# EAGLE schematic plane (EAGLE 9.6.1)
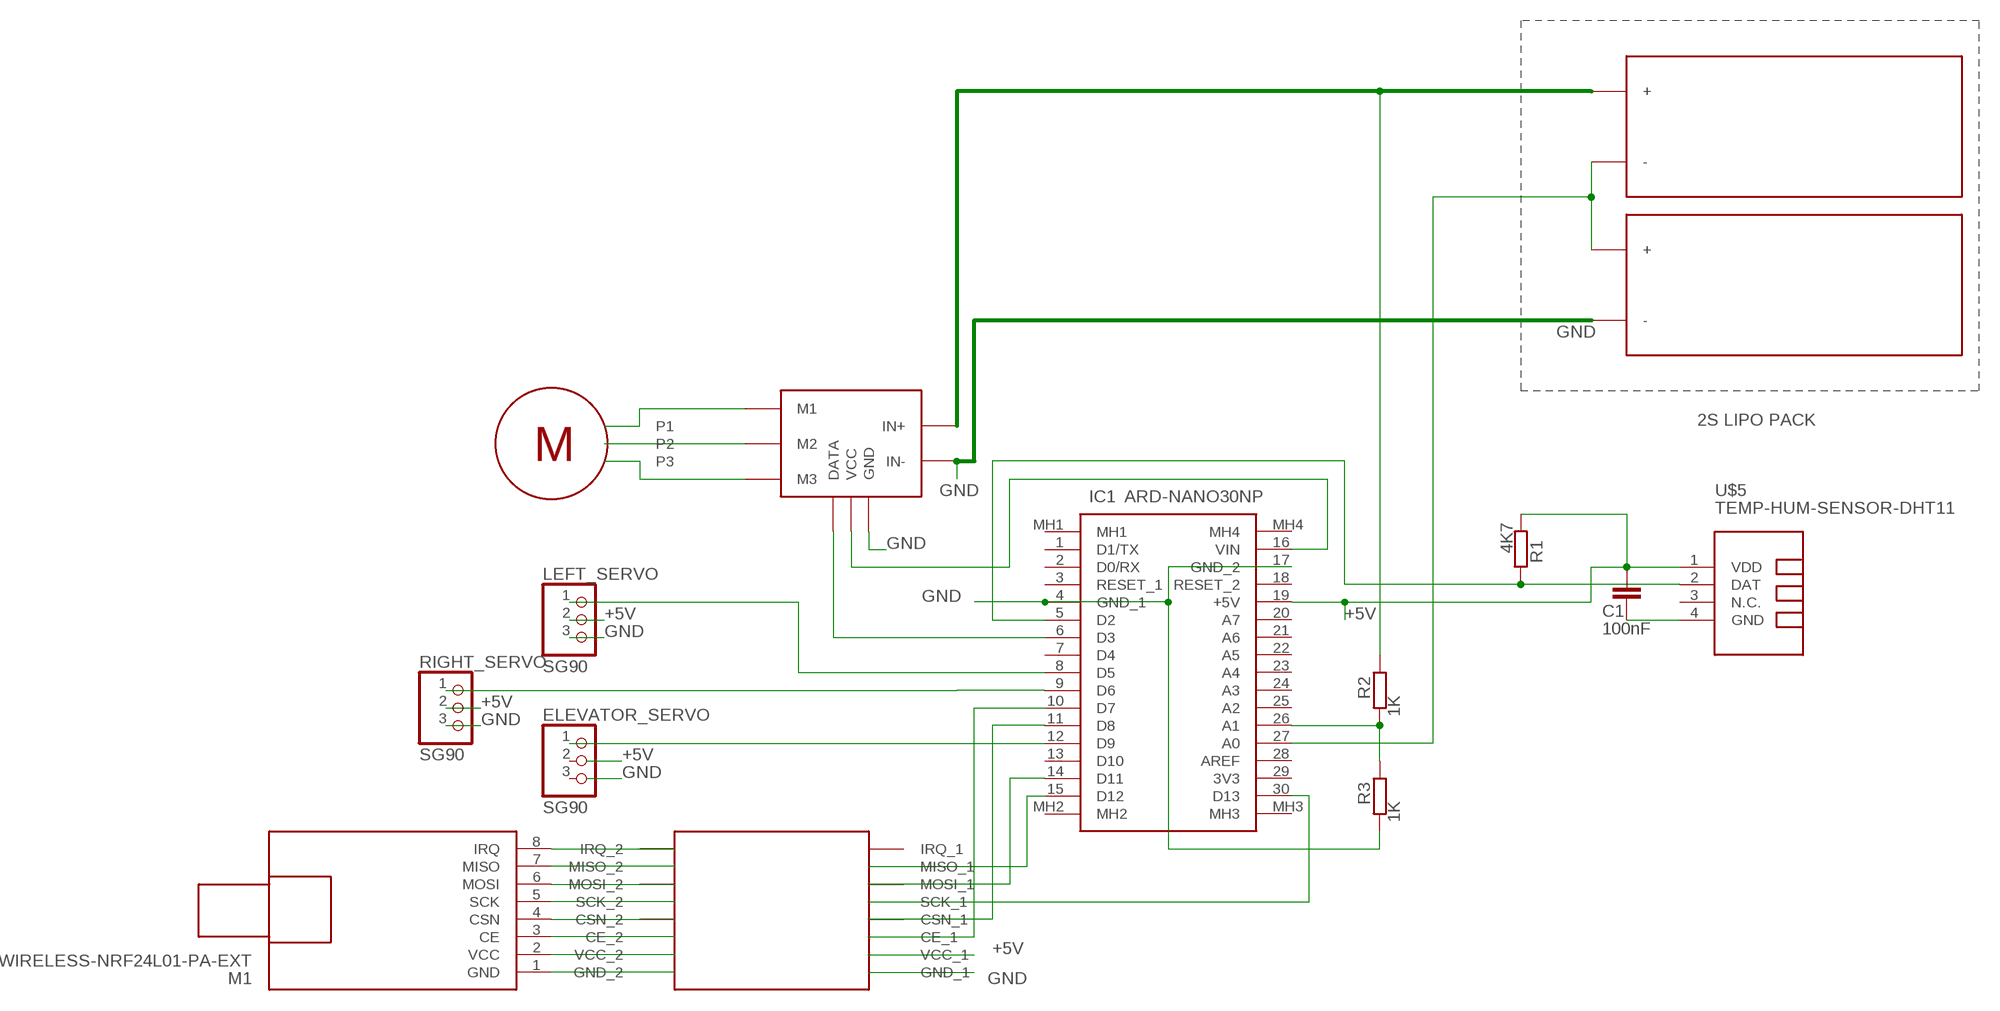
[diagram p0: schematic, sheet 1]

## Parts
C1  100nF  C2,5-3  [C2.5-3]
ELEVATOR_SERVO  SG90  PINHD-1X3  [1X03]
IC1  ARD-NANO30NP  [ARDNANO30NP]
LEFT_SERVO  SG90  PINHD-1X3  [1X03]
M1  WIRELESS-NRF24L01-PA-EXT  [WIRELESS-NRF24L01-PA-EXT]
R1  4K7  SMR  [SMR]
R2  1K  SMR  [SMR]
R3  1K  SMR  [SMR]
RIGHT_SERVO  SG90  PINHD-1X3  [1X03]
U$1  ESC  (no package)
U$2  LIPO-CELL  (no package)
U$3  LIPO-CELL  (no package)
U$4  A2212/6T  (no package)
U$5  TEMP-HUM-SENSOR-DHT11  [TEMP-HUM-SENSOR-DHT11]
U$6  YL-105-ADAPTER-NRF24L01  (no package)

## Nets
+5V: C1.1 IC1.19(+5V) LEFT_SERVO.2 R1.2 RIGHT_SERVO.2 U$5.1(VDD) U$6.VCC_1
GND: IC1.4(GND_1) IC1.17(GND_2) LEFT_SERVO.3 M1.1(GND) R3.2 RIGHT_SERVO.3 U$1.GND U$1.IN- U$2.- U$6.GND_1 U$6.GND_2
N$1: IC1.8(D5) LEFT_SERVO.1
N$2: IC1.9(D6) RIGHT_SERVO.1
N$3: ELEVATOR_SERVO.1 IC1.12(D9)
N$4: IC1.16(VIN) U$1.VCC
N$5: IC1.27(A0) U$2.+ U$3.-
N$6: IC1.26(A1) R2.2 R3.1
N$7: U$1.M1 U$4.P1
N$8: U$1.M2 U$4.P2
N$9: U$1.M3 U$4.P3
N$10: C1.2 U$5.4(GND)
N$11: IC1.5(D2) R1.1 U$5.2(DAT)
N$12: IC1.6(D3) U$1.DATA
N$13: R2.1 U$1.IN+ U$3.+
N$14: M1.2(VCC) U$6.VCC_2
N$15: M1.3(CE) U$6.CE_2
N$16: M1.4(CSN) U$6.CSN_2
N$17: M1.5(SCK) U$6.SCK_2
N$18: M1.6(MOSI) U$6.MOSI_2
N$19: M1.7(MISO) U$6.MISO_2
N$20: M1.8(IRQ) U$6.IRQ_2
N$21: IC1.14(D11) U$6.MOSI_1
N$22: IC1.15(D12) U$6.MISO_1
N$23: IC1.30(D13) U$6.SCK_1
N$24: IC1.10(D7) U$6.CE_1
N$25: IC1.11(D8) U$6.CSN_1
Unconnected: ELEVATOR_SERVO.2 ELEVATOR_SERVO.3 IC1.1(D1/TX) IC1.2(D0/RX) IC1.3(RESET_1) IC1.7(D4) IC1.13(D10) IC1.18(RESET_2) IC1.20(A7) IC1.21(A6) IC1.22(A5) IC1.23(A4) IC1.24(A3) IC1.25(A2) IC1.28(AREF) IC1.29(3V3) IC1.MH1 IC1.MH2 IC1.MH3 IC1.MH4 U$5.3(N.C.) U$6.IRQ_1

## Notes on the sheet
- 2S LIPO PACK

## Library data of the parts
C1 = capacitor-wima:C: CAPACITOR naming: grid - package width
ELEVATOR_SERVO LEFT_SERVO RIGHT_SERVO = adafruit:PINHD-1X3: PIN HEADER
IC1 = SamacSys_Parts:ARD-NANO30NP: Development Boards & Kits - AVR Arduino Nano 3.1 W/ATMEGA328 NO-PIN Source: Datasheet <http://www.mouser.com/datasheet/2/595/Arduino_Nano3_0-220057.pdf>; ARROW_PART_NUMBER: ARD-NANO30NP; DESCRIPTION: Development Boards & Kits - AVR Arduino Nano 3.1 W/ATMEGA328 NO-PIN; HEIGHT: 5mm; MANUFACTURER_NAME: Gravitech; MANUFACTURER_PART_NUMBER: ARD-NANO30NP; MOUSER_PART_NUMBER: 992-ARD-NANO30NP; MOUSER_PRICE-STOCK: https://www.mouser.co.uk/ProductDetail/Gravitech/ARD-NANO30NP?qs=Vxac6xGyzPlh7in3DWNTbQ%3D%3D
M1 = diy-modules:WIRELESS-NRF24L01-PA-EXT: 2.4 GHz Wireless Module based on NRF24L01 chip with preamplifier and external antenna Click here to find device on ebay.com <http://www.ebay.com/sch/nrf24l01+pa+lna+sma>
R1-R3 = resistor-shunt:SMR: SMD SHUNT RESISTOR; OC_FARNELL: unknown; OC_NEWARK: unknown
U$1 = SamacSys_Parts:ESC
U$2 U$3 = SamacSys_Parts:LIPO-CELL
U$4 = SamacSys_Parts:A2212/6T
U$5 = diy-modules:TEMP-HUM-SENSOR-DHT11: DHT11 - digital humidity & temperature sensor DHT11 datasheet available here: https://akizukidenshi.com/download/ds/aosong/DHT11.pdf Click here to find device on ebay.com <http://www.ebay.com/sch/dht11+digital+sensor>
U$6 = diy-modules:YL-105-ADAPTER-NRF24L01